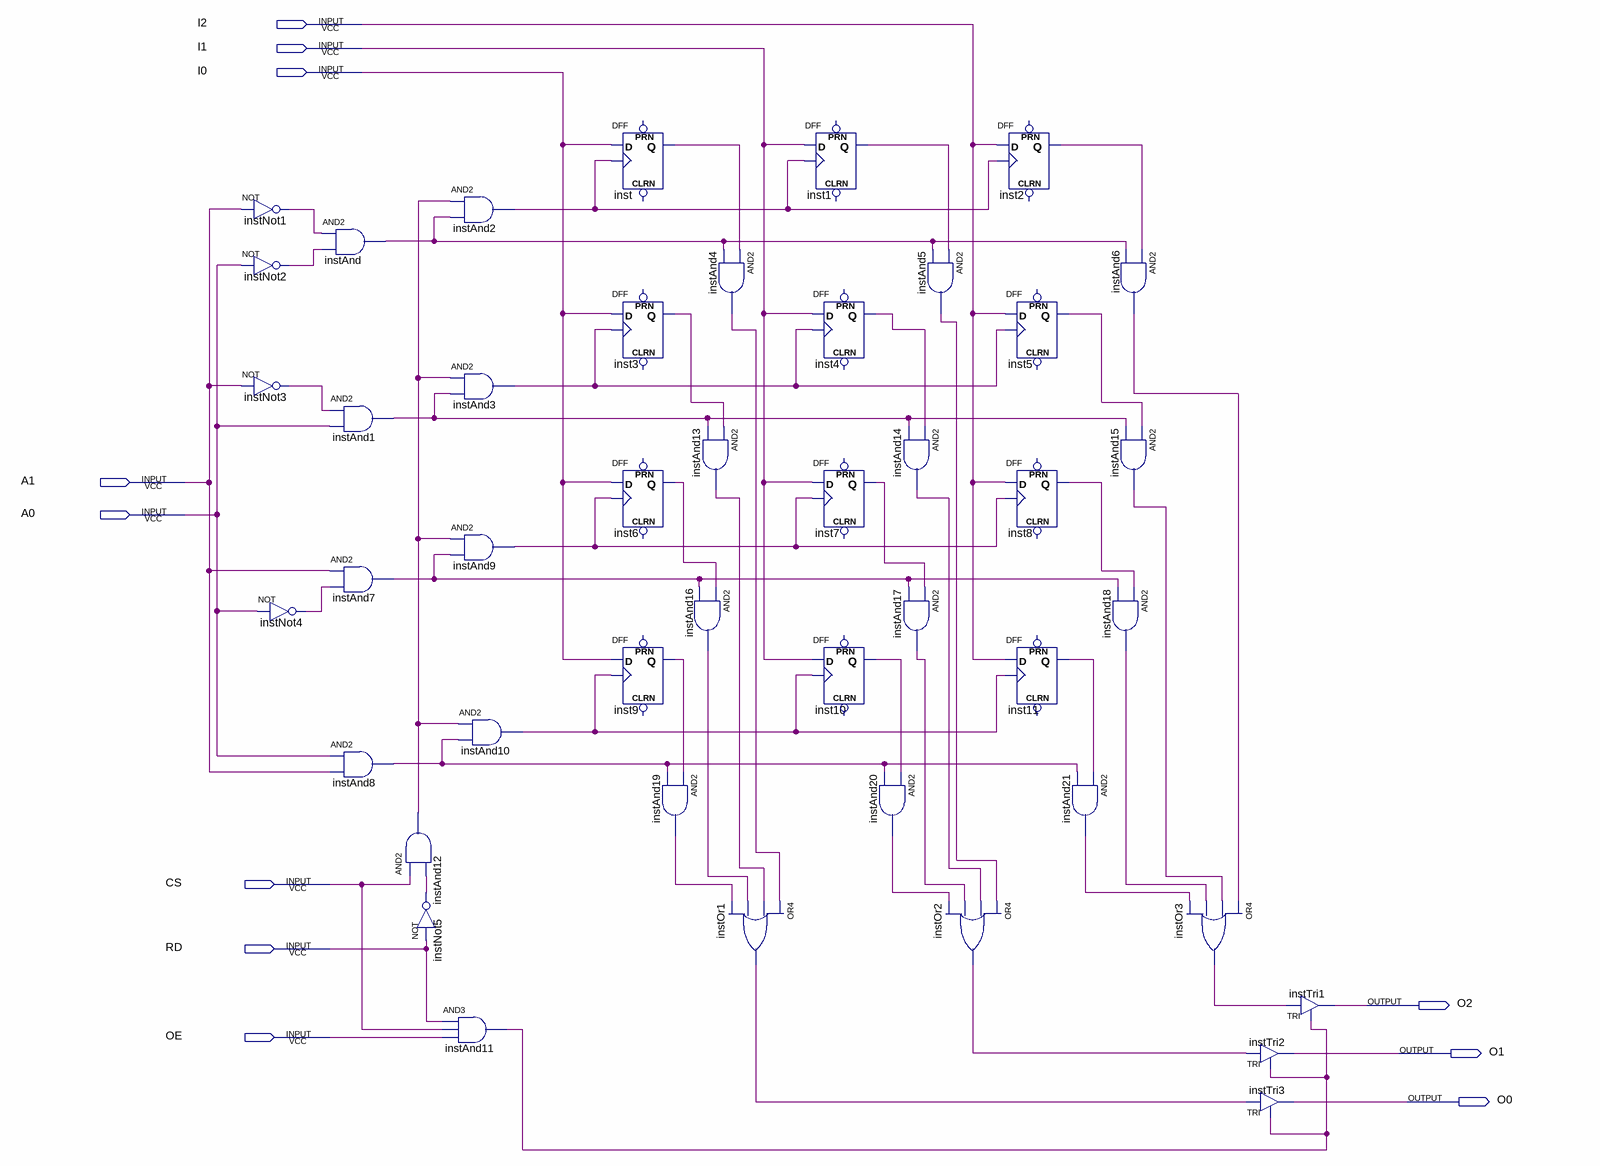
[diagram p0: schematic sheet]
// Quartus schematic mem_4x3.bdf as structural Verilog: 45 symbols, 11 pins
module mem_4x3 (
  input  I2,
  input  I1,
  input  I0,
  input  A1,
  input  A0,
  input  CS,
  input  RD,
  input  OE,
  output O2,
  output O1,
  output O0
);

  wire inst1_q, inst2_q, inst3_q, inst4_q, inst5_q, inst6_q, inst7_q, inst8_q, inst9_q, inst10_q, inst11_q,
       inst_q, instAnd1_out, instAnd2_out, instAnd3_out, instAnd4_out, instAnd5_out, instAnd6_out,
       instAnd7_out, instAnd8_out, instAnd9_out, instAnd10_out, instAnd11_out, instAnd12_out, instAnd13_out,
       instAnd14_out, instAnd15_out, instAnd16_out, instAnd17_out, instAnd18_out, instAnd19_out,
       instAnd20_out, instAnd21_out, instAnd_out, instNot1_out, instNot2_out, instNot3_out, instNot4_out,
       instNot5_out, instOr1_out, instOr2_out, instOr3_out;

  not instNot1 (instNot1_out, A1);
  not instNot2 (instNot2_out, A0);
  not instNot3 (instNot3_out, A1);
  not instNot4 (instNot4_out, A0);
  and instAnd (instAnd_out, instNot1_out, instNot2_out);
  and instAnd1 (instAnd1_out, instNot3_out, A0);
  and instAnd7 (instAnd7_out, A1, instNot4_out);
  and instAnd8 (instAnd8_out, A0, A1);
  and instAnd12 (instAnd12_out, CS, instNot5_out);
  not instNot5 (instNot5_out, RD);
  and instAnd2 (instAnd2_out, instAnd12_out, instAnd_out);
  and instAnd3 (instAnd3_out, instAnd12_out, instAnd1_out);
  and instAnd9 (instAnd9_out, instAnd12_out, instAnd7_out);
  and instAnd10 (instAnd10_out, instAnd12_out, instAnd8_out);
  and instAnd11 (instAnd11_out, RD, CS, OE);
  DFF inst (.CLK(instAnd2_out), .D(I0), .Q(inst_q));  // open: CLRN, PRN
  DFF inst3 (.CLK(instAnd3_out), .D(I0), .Q(inst3_q));  // open: CLRN, PRN
  DFF inst6 (.CLK(instAnd9_out), .D(I0), .Q(inst6_q));  // open: CLRN, PRN
  DFF inst9 (.CLK(instAnd10_out), .D(I0), .Q(inst9_q));  // open: CLRN, PRN
  and instAnd19 (instAnd19_out, inst9_q, instAnd8_out);
  and instAnd4 (instAnd4_out, inst_q, instAnd_out);
  and instAnd13 (instAnd13_out, inst3_q, instAnd1_out);
  and instAnd16 (instAnd16_out, inst6_q, instAnd7_out);
  or instOr1 (instOr1_out, instAnd4_out, instAnd13_out, instAnd16_out, instAnd19_out);
  DFF inst1 (.CLK(instAnd2_out), .D(I1), .Q(inst1_q));  // open: CLRN, PRN
  DFF inst4 (.CLK(instAnd3_out), .D(I1), .Q(inst4_q));  // open: CLRN, PRN
  DFF inst7 (.CLK(instAnd9_out), .D(I1), .Q(inst7_q));  // open: CLRN, PRN
  DFF inst10 (.CLK(instAnd10_out), .D(I1), .Q(inst10_q));  // open: CLRN, PRN
  and instAnd20 (instAnd20_out, inst10_q, instAnd8_out);
  and instAnd5 (instAnd5_out, inst1_q, instAnd_out);
  and instAnd14 (instAnd14_out, inst4_q, instAnd1_out);
  and instAnd17 (instAnd17_out, inst7_q, instAnd7_out);
  or instOr2 (instOr2_out, instAnd5_out, instAnd14_out, instAnd17_out, instAnd20_out);
  DFF inst2 (.CLK(instAnd2_out), .D(I2), .Q(inst2_q));  // open: CLRN, PRN
  DFF inst5 (.CLK(instAnd3_out), .D(I2), .Q(inst5_q));  // open: CLRN, PRN
  DFF inst8 (.CLK(instAnd9_out), .D(I2), .Q(inst8_q));  // open: CLRN, PRN
  DFF inst11 (.CLK(instAnd10_out), .D(I2), .Q(inst11_q));  // open: CLRN, PRN
  and instAnd21 (instAnd21_out, inst11_q, instAnd8_out);
  and instAnd6 (instAnd6_out, inst2_q, instAnd_out);
  and instAnd15 (instAnd15_out, inst5_q, instAnd1_out);
  and instAnd18 (instAnd18_out, inst8_q, instAnd7_out);
  or instOr3 (instOr3_out, instAnd6_out, instAnd15_out, instAnd18_out, instAnd21_out);
  TRI instTri2 (.IN(instOr2_out), .OE(instAnd11_out), .OUT(O1));
  TRI instTri3 (.IN(instOr1_out), .OE(instAnd11_out), .OUT(O0));
  TRI instTri1 (.IN(instOr3_out), .OE(instAnd11_out), .OUT(O2));
endmodule
